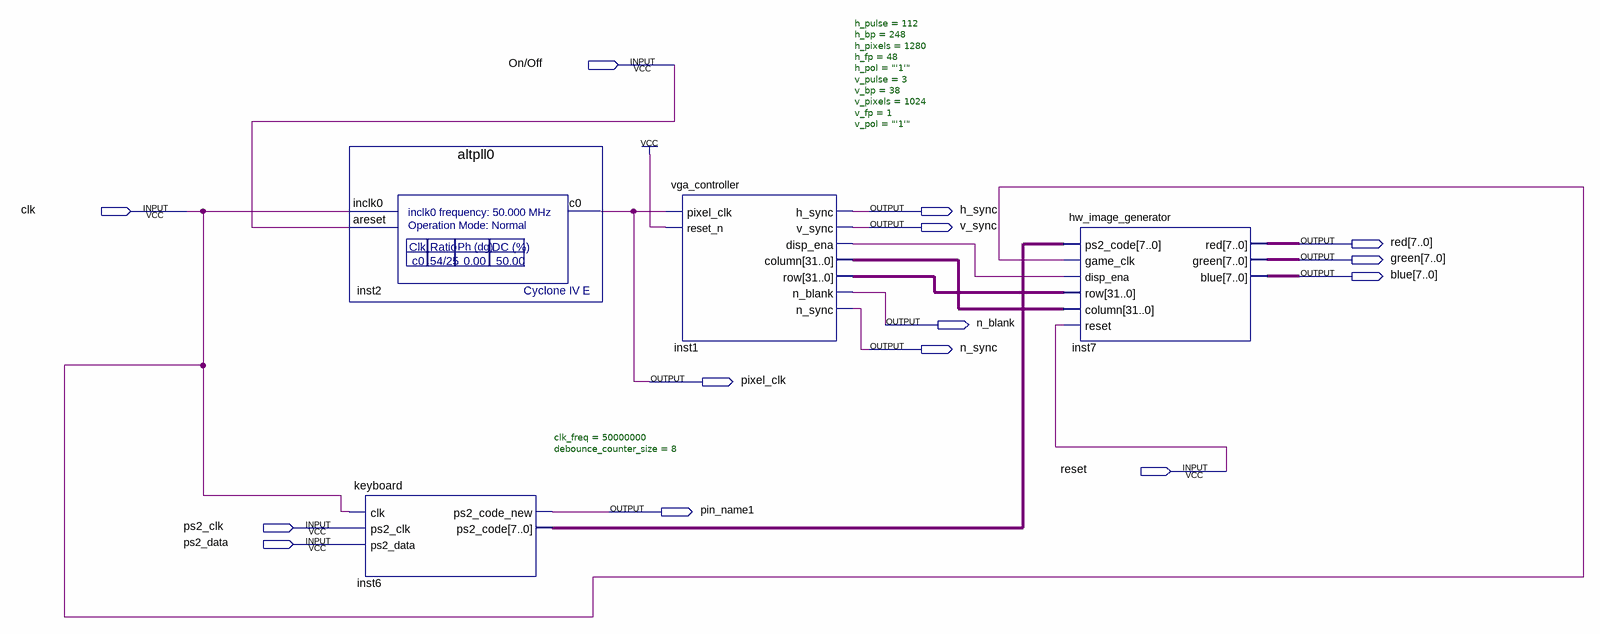
[diagram p0: schematic sheet]
// Quartus schematic vga_with_hw_test_image.bdf as structural Verilog: 4 symbols, 14 pins
module vga_with_hw_test_image (
  input  \On/Off ,
  input  clk,
  input  reset,
  input  ps2_clk,
  input  ps2_data,
  output h_sync,
  output v_sync,
  output [7:0] red,
  output [7:0] green,
  output [7:0] blue,
  output n_blank,
  output n_sync,
  output pixel_clk,
  output pin_name1
);

  wire inst1_disp_ena;
  wire [7:0] inst6_ps2_code;
  wire [31:0] inst1_column, inst1_row;

  altpll0 inst2 (.inclk0(clk), .areset(\On/Off ), .c0(pixel_clk));
  keyboard #(.clk_freq(50000000), .debounce_counter_size(8)) inst6 (
    .clk(clk), .ps2_clk(ps2_clk), .ps2_data(ps2_data), .ps2_code_new(pin_name1), .ps2_code(inst6_ps2_code));
  vga_controller #(.h_pulse(112), .h_bp(248), .h_pixels(1280), .h_fp(48), .h_pol("'1'"), .v_pulse(3), .v_bp(38), .v_pixels(1024), .v_fp(1), .v_pol("'1'")) inst1 (
    .pixel_clk(pixel_clk), .reset_n(1'b1), .h_sync(h_sync), .v_sync(v_sync), .disp_ena(inst1_disp_ena),
    .column(inst1_column), .row(inst1_row), .n_blank(n_blank), .n_sync(n_sync));
  hw_image_generator inst7 (
    .ps2_code(inst6_ps2_code), .game_clk(clk), .disp_ena(inst1_disp_ena), .row(inst1_row),
    .column(inst1_column), .reset(reset), .red(red), .green(green), .blue(blue));
endmodule
